# Altium schematic sheet Sense2Pin.SchDoc
size B
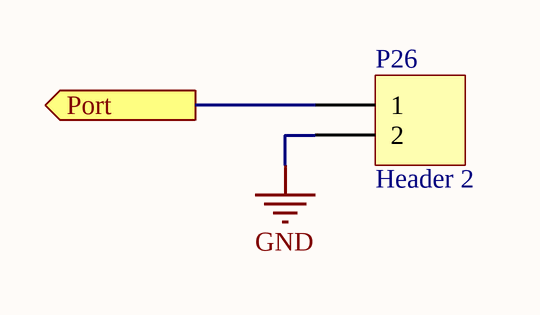
[diagram p0: Sense2Pin.SchDoc]

## Parts
P26  Header 2  [HDR1X2]

## Ports
Port (out)

## Nets
GND: P26.2
Port: P26.1 ; port Port

## Library data of the parts
P26 = Header 2: Header, 2-Pin; LatestRevisionDate: 17-Jul-2002; LatestRevisionNote: Re-released for DXP Platform.; Publisher: Altium Limited